# Altium schematic sheet Controller.SchDoc
size A; SheetNumber: 4; SheetTotal: 4
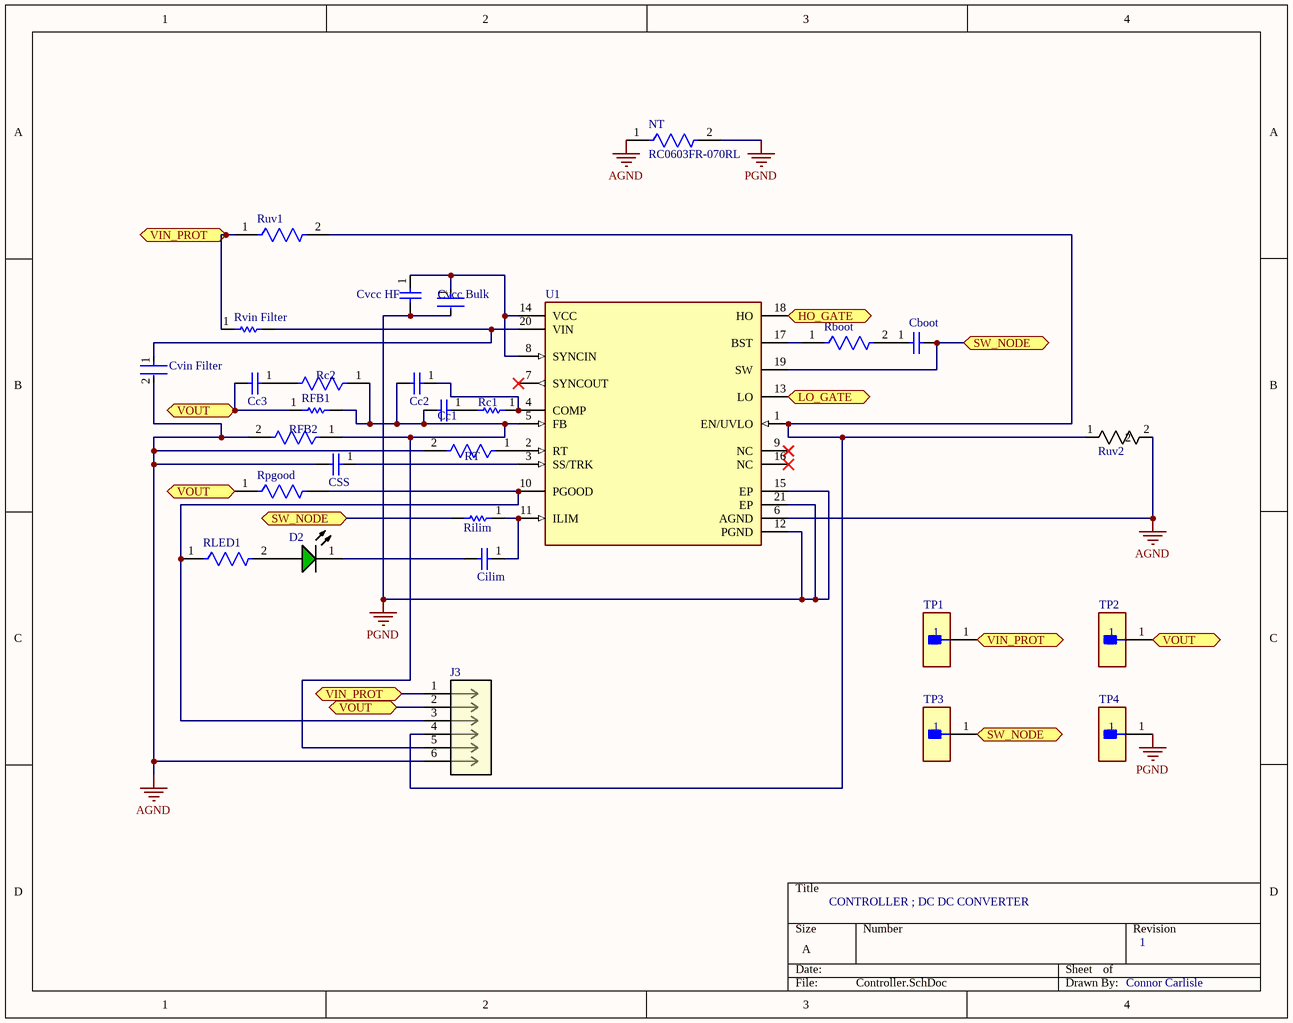
[diagram p0: Controller.SchDoc]

## Parts
Cboot  GRM188R71C104KA01D  [MURA-0603_H_0.9_M]  (value not drawn)
Cc1  GRM188R71H332KA01D  [CAPC1608X90X35LL10T15]  (value not drawn)
Cc2  GRM1885C1H560JA01D  [CAPC1608X90X35NL10T15]  (value not drawn)
Cc3  GRM1885C1H681JA01D  [CAPC1608X90X35ML10T15]  (value not drawn)
Cilim  GRM1885C1H220JA01D  [CAPC1608X90X35ML10T15]  (value not drawn)
CSS  GRM188R71C473KA01D  [CAPC1608X90X35ML10T15]  (value not drawn)
Cvcc_Bulk  GRM188Z71C225KE43D  [FP-GRM188-0_2-MFG]  (value not drawn)
Cvcc_HF  GRM188R71C104KA01D  [MURA-0603_H_0.9_M]  (value not drawn)
Cvin_Filter  GRM188R72A104KA35D  [FP-GRM188-0_1-e0_2_0_5-IPC_B]  (value not drawn)
D2  LTST-C170KGKT  [LTST-LTST-C170KGKT-2_V]  (value not drawn)
J3  PRPC006SAAN-RC  [CONN6_PRPC006SAAN-RC_SUL]  (value not drawn)
NT  RC0603FR-070RL  [FP-RC0603-MFG]
Rboot  RC0603FR-072R2L  [FP-RC0603-0_55-IPC_A]  (value not drawn)
Rc1  RC0603FR-0715KL  [RESC1608X55X25LL10T15]  (value not drawn)
Rc2  RC0603FR-07100RL  [FP-RC0603-0_55-MFG]  (value not drawn)
RFB1  RC0603FR-0752K3L  [RESC1608X55X25LL10T15]  (value not drawn)
RFB2  RC0603FR-0710KL  [FP-RC0603-0_55-IPC_C]  (value not drawn)
Rilim  RC0603FR-07147RL  [RESC1608X55X25NL10T15]  (value not drawn)
RLED1  RC0603FR-071KL  [FP-RC0603-0_55-IPC_C]  (value not drawn)
Rpgood  RC0603FR-07100KL  [FP-RC0603-0_55-MFG]  (value not drawn)
RT  RC0603FR-0720KL  [FP-RC0603-0_55-IPC_C]  (value not drawn)
Ruv1  RC0603FR-07100KL  [FP-RC0603-0_55-MFG]  (value not drawn)
Ruv2  RC0603FR-0717K8L  [RC0603N_YAG]  (value not drawn)
Rvin_Filter  4R7 1% 0603(1608)  [RESC0603(1608)_M]  (value not drawn)
TP1  5015  [FP-5015-MFG]  (value not drawn)
TP2  5015  [FP-5015-MFG]  (value not drawn)
TP3  5015  [FP-5015-MFG]  (value not drawn)
TP4  5015  [FP-5015-MFG]  (value not drawn)
U1  LM5145RGYR  [FP-RGY0020B-MFG]  (value not drawn)

## Ports
HO_GATE (bidir, see Top[2C], Power_Stage[2B]), LO_GATE (bidir, see Top[2C], Power_Stage[3C]), SW_NODE (bidir, see Top[2C], Power_Stage[3B]), VIN_PROT (bidir, see Top[2B], Input_Protection[3B], Power_Stage[1B]), VOUT (bidir, see Top[2C], Power_Stage[3B])

## Nets
AGND: CSS.2 Cvin_Filter.2 J3.6 NT.1 RFB2.2 RT.2 Ruv2.2 U1.6(AGND)
PGND: Cvcc_Bulk.2 Cvcc_HF.2 NT.2 TP4.1 U1.12(PGND) U1.15(EP) U1.21(EP)
HO_GATE: U1.18(HO) ; port HO_GATE
LO_GATE: U1.13(LO) ; port LO_GATE
SW_NODE: Cboot.2 Rilim.2 TP3.1 U1.19(SW) ; port SW_NODE
VIN_PROT: J3.1 Ruv1.1 Rvin_Filter.1 TP1.1 ; port VIN_PROT
VOUT: Cc3.2 J3.2 RFB1.1 Rpgood.1 TP2.1 ; port VOUT
NetCboot_1: Cboot.1 Rboot.2
NetCc1_1: Cc1.1 Rc1.2
NetCc1_2: Cc1.2 Cc2.2 J3.5 Rc2.1 RFB1.2 RFB2.1 U1.5(FB)
NetCc2_1: Cc2.1 Rc1.1 U1.4(COMP)
NetCc3_1: Cc3.1 Rc2.2
NetCilim_1: Cilim.1 Rilim.1 U1.11(ILIM)
NetCilim_2: Cilim.2 D2.1(K)
NetCSS_1: CSS.1 U1.3(SS/TRK)
NetCvcc_Bulk_1: Cvcc_Bulk.1 Cvcc_HF.1 U1.8(SYNCIN) U1.14(VCC)
NetCvin_Filter_1: Cvin_Filter.1 Rvin_Filter.2 U1.20(VIN)
NetD2_2: D2.2(A) RLED1.2
NetJ3_3: J3.3 RLED1.1 Rpgood.2 U1.10(PGOOD)
NetJ3_4: J3.4 Ruv1.2 Ruv2.1 U1.1(EN/UVLO)
NetRboot_1: Rboot.1 U1.17(BST)
NetRT_1: RT.1 U1.2(RT)

Not connected (* = marked no-connect by the designer): U1 7(SYNCOUT)* 9(NC)* 16(NC)*

## Notes on the sheet
- CONTROLLER ; DC DC CONVERTER
- 1
- Connor Carlisle

## Library data of the parts
Cboot Cvcc_HF = CMP-2000-05253-1: CAP, Ceramic, 0.1 uF, 10%, 16 V, 0603, RoHS, Tape and Reel; Manufacturer: Murata; Capacitance - pF: 100000pF; Case Length: 1.6mm; Voltage Rating DC: 16V; Brand: MurataElectronics; Temperature Coefficient / Code: +/-15%; Case Width: 0.8mm; Capacitance: 0.1uF; Dielectric: X7R; Capacitance - nF: 100nF; Product Category: MultilayerCeramicCapacitorsMLCC-SMD/SMT; Datasheet URL: https://datasheet.ciiva.com/29202/451467-da-01-en-vs-kondensator-0603-29202287.pdf; Termination Style: SMD/SMT; Operating Temperature Range: -55Cto+125C; Case Code - in: 0603; Datasheet Version: Dec-10; Dimensions: 0.8mmWx1.6mmLx0.8mmH; RoHS: Details; Case Code - mm: 1608; Product: GeneralTypeMLCCs; Voltage Rating: 16V; Package / Case: 0603(1608metric); Factory Pack Quantity: 4000; Packaging: Reel; Maximum Operating Temperature: +125C; Manufacturer URL: http://www.murata.com/; Type: GeneralPurposeMLCC; Case Height: 0.8mm; Minimum Operating Temperature: -55C; Series: GRM; Tolerance: 10%
Cc1 = CMP-2006-02916-1: Manufacturer: Murata; Part Number: GRM188R71H332KA01D
Cc2 = CMP-2006-02680-1: Manufacturer: Murata; Part Number: GRM1885C1H560JA01D
Cc3 = CMP-2006-02690-1: Manufacturer: Murata; Part Number: GRM1885C1H681JA01D
Cilim = CMP-2000-04945-1: Chip Capacitor, 22 pF, +/- 5%, 50 V, -55 to 125 degC, 0603 (1608 Metric), RoHS, Tape and Reel; Manufacturer: Murata; Capacitance: 22pF; Rated Voltage: 50V; Dielectric: C0G; Manufacturer URL: http://www.murata.com/; Datasheet Version: Jul-06; Package Reference: 603; Tolerance (%): ±5%; Case Size/Dimension: 0603; Package Description: 2-Pin Surface Mount Device, Body 1.6 x 0.8 mm; Datasheet URL: https://datasheet.ciiva.com/11786/0900766b807a1cab-11786398.pdf
CSS = CMP-2006-02858-1: Manufacturer: Murata; Part Number: GRM188R71C473KA01D
Cvcc_Bulk = CMP-06035-057307-1: Chip Multilayer Ceramic Capacitors for General Purpose, 0603, 2.2uF, X7R, 15%, 10%, 16V; Case/Package: 0603
Cvin_Filter = CMP-1035-02595-8: Chip Multilayer Ceramic Capacitors for General Purpose, 0603, 0.10uF, X7R, 15%, 10%, 100V; Capacitance: 100nF; Voltage Rating (DC): 100V; Material: Ceramic; Packaging: Tape and Reel; Dielectric: X7R; Case Code (Imperial): 0603; Package Quantity: 1; Height: 0.8mm; Weight: 0.000222oz; Min Operating Temperature: -55°C; Depth: 0.8mm; Mount: Surface Mount; Thickness: 0.035inch; Voltage: 100V; REACH SVHC: No SVHC; Case/Package: 0603; Voltage Rating: 100V; Width: 0.8mm; Tolerance: 10%; Lead Free: Lead Free; Case Code (Metric): 1608; Radiation Hardening: No; Max Operating Temperature: 125°C; Termination: SMD/SMT; Length: 1.6mm
D2 = CMP-2000-06620-1: Ultra Bright AlInGaP Chip LED, 75 mW, -55 to 85 degC, 2-Pin SMD (0805), RoHS, Tape and Reel; Manufacturer: Lite-On; Forward Current: 30mA; Power Dissipation Max: 75mW; Emitting Color: YellowGreen; Type: Uni-Color; Forward Voltage: 2.4V; Dominant Wave Length: 571nm; Test Current (It): 20mA; Product Length (mm): 2mm; Peak Wavelength: 574nm; Power Dissipation: 75W; Product Depth (mm): 1.25mm; DELETED: Compliant; High Brightness: Yes; Product Height (mm): 1.1mm; Luminous Intensity: 35mcd; Shape Type: Rectangular; Chip Material: AlGaInP; Viewing Angle: 130deg; Number of  Elements: 1; Reverse Voltage: 5V; Rad Hardened: No; Package Type: ChipLed; Manufacturer URL: http://www.us.liteon.com/; Mounting: SurfaceMount; Operating Temp Range: -55Cto85C; Datasheet URL: http://optoelectronics.liteon.com/upload/download/DS22-2000-073/S_110_LTST-C170KGKT.pdf; Packaging: TapeandReel; Pin Count: 2; Package Description: 2-Pin Surface Mounted Device, Body 2 x 1.25 mm; Mounting Technology: SurfaceMount; Package Reference: LTST-C170KGKT-2; Forward Current Max: 30mA; Datasheet Version: Rev. G, 06/2005; Lens Dimensions: 1.4x1.25x0.6mm; Operating Temperature Classification: Industrial; Lum Intensity: 35mcd; Main Category: ChipLED
J3 = CMP-028-000000-1: Description; Manufacturer_Name: Sullins; Type: Headers, Male Pins; Copyright: Copyright (C) 2025 Ultra Librarian. All rights reserved.; Design Item ID: PRPC006SAAN-RC; RefDes: RefDes; Manufacturer_Part_Number: PRPC006SAAN-RC; Source: PRPC006SAAN-RC.SchLib
NT = CMP-2000-06925-2: RES SMD 0 OHM JUMPER 1/10W 0603; Manufacturer: Yageo; Tolerance: 1%; Value: 0Ω; Power Rating: 0.1W; Voltage Rating: 75V; Composition: Thick Film; Temperature Range Low: -55°C; Ipc Land Pattern Name: RESC16080X45; Lead Free: Yes; Digikey Description: RES SMD 0 OHM JUMPER 1/10W 0603; Height: 0.55mm; Automotive: No; Device Class L3: Chip SMD Resistors; Device Class L1: Passive Components; Device Class L2: Resistors; Footprint Url: http://www.yageo.com/exep/pages/download/literatures/PYu-R_Mount_10.pdf; Category: Res; Mouser Description: RC Series 0603 0.1 W 0 O Jumper Surface Mount Thick Film Chip Resistor; Resistance: 0Ω; ComponentLink2URL: http://www.yageo.com/documents/recent/PYu-RC_Group_51_RoHS_L_10.pdf; Series: RC_L; ComponentLink2Description: Datasheet; RoHS: TRUE; Temperature: -55°C to +155°C; Temperature Range High: +155°C; Package: RC0603; Octopart: https://octopart.com/rc0603fr-070rl-yageo-1180803; Manufacturer Part Number: RC0603FR-070RL
Rboot = CMP-03412-037810-1: RES SMD 2.2 OHM 1% 1/10W 0603; Voltage Rating: 50V; Max Power Dissipation: 100mW; Resistance: 2.2R; Temperature Coefficient: 200ppm/°C; Lead Free: Lead Free; Series: RC; Resistor Type: Thick Film; Case Code (Imperial): 0603; Number of Pins: 2; Min Operating Temperature: -55°C; Packaging: Tape and Reel; Length: 0.063inch; Power Rating: 100mW; Features: Moisture Resistant; Resistance Tolerance: 1%; Termination: SMD/SMT; Width: 0.031inch; REACH SVHC: No SVHC; Case Code (Metric): 1608; Height: 0.022inch; Voltage Rating (DC): 50V; Size Code: 0603; Max Operating Temperature: 155°C; Case/Package: 0603; Number of Terminations: 2; Depth: 0.8mm; Tolerance: 1%; RoHS Compliant: Yes; Technology: THICK FILM; Package Quantity: 1
Rc1 = CMP-1659-00032-1: Chip Resistor, 15 KOhm, +/- 1%, 0.1 W, -55 to 155 degC, 0603 (1608 Metric), RoHS, Tape and Reel; PackageDescription: 2-Pin Surface Mount Device, Body 1.6 x 0.8 mm; RoHSCompliant: true; ComponentLink2Description: Datasheet; DatasheetVersion: Rev. 4, 02/2016; ComponentLink1Description: Manufacturer URL; ComponentLink1URL: http://www.yageo.com/; PackageReference: 0603; ComponentLink2URL: http://www.yageo.com/documents/recent/PYu-RC_Group_51_RoHS_L_04.pdf
Rc2 = CMP-2100-03663-2: NexarPartId: 55402879; Voltage Rating: 50V; Power Rating: 100mW; Tolerance: 1%; Temperature Coefficient: 100ppm/°C; Resistance: 100Ω; Case/Package: 0603; Military Standard: Not; REACH SVHC: Unknown; Case Code (Metric): 0603; Max Operating Temperature: 155°C; Schedule B: 8533210045, 8533210045; Height: 450µm; Length: 1.6mm; Lead Free: Lead Free; Packaging: Tape & Reel; Case Code (Imperial): 0603; Composition: Thick Film; Min Operating Temperature: -55°C; Voltage Rating (DC): 50V; RoHS: Compliant; Depth: 800µm; Number of Pins: 2; Termination: SMD/SMT; Width: 800µm
RFB1 = CMP-1012-00705-2: Manufacturer: Yageo; Part Number: RC0603FR-0752K3L
RFB2 = CMP-2100-03664-2: RES 10K OHM 1% 1/10W 0603; Voltage Rating: 75V; Voltage Rating (DC): 50V; Resistance: 10kR; Power Rating: 100mW; Temperature Coefficient: 100ppm/°C; Depth: 0.8mm; Termination: SMD/SMT; Resistor Type: Thick Film; Series: RC; Construction: Rectangular; Features: Moisture Resistant; Packaging: Tape and Reel; Min Operating Temperature: -55°C; Number of Terminations: 2; Lead Pitch: 0.3mm; RoHS Compliant: Yes; Case/Package: 0603; Resistance Tolerance: 1%; Military Standard: Not; Weight: 7.1E-05oz; Number of Pins: 2; Tolerance: 1%; Length: 1.6mm; Case Code (Imperial): 0603; Lead Free: Lead Free; Width: 0.8mm; Max Power Dissipation: 100mW; Height: 0.45mm; Max Operating Temperature: 155°C; Case Code (Metric): 1608; Size Code: 0603
Rilim = CMP-2000-04904-1: Manufacturer: Yageo; Part Number: RC0603FR-07147RL
RLED1 = CMP-1659-00009-5: RES 1K OHM 1% 1/10W 0603; Resistance: 1kR; Voltage Rating: 50V; Power Rating: 100mW; Temperature Coefficient: 100ppm/°C; Military Standard: Not; REACH SVHC: No SVHC; Size Code: 0603; Features: Moisture Resistant; Number of Terminations: 2; Technology: THICK FILM; Series: RC; Case Code (Metric): 1608; Resistance Tolerance: 1%; Resistor Type: Thick Film; Termination: SMD/SMT; Contact Plating: Tin; Radiation Hardening: No; Min Operating Temperature: -55°C; Max Operating Temperature: 155°C; Packaging: Tape and Reel; Max Power Dissipation: 100mW; RoHS Compliant: Yes; Height: 0.45mm; Lead Free: Lead Free; Case/Package: 0603; Length: 1.6mm; Tolerance: 1%; Case Code (Imperial): 0603; Construction: Rectangular; Depth: 0.8mm
Rpgood Ruv1 = CMP-2100-03662-2: RES SMD 100K OHM 1% 1/10W 0603; Voltage Rating (DC): 50V; Resistance: 100kR; Max Power Dissipation: 100mW; Temperature Coefficient: 100ppm/°C; Working Voltage: 75V; Length: 1.6mm; Lead Free: Lead Free; Number of Terminations: 2; Packaging: Tape and Reel; Voltage Rating: 50V; Termination: SMD/SMT; Width: 0.8mm; Resistor Type: Thick Film; Resistance Tolerance: 1%; Features: Moisture Resistant; Height: 0.45mm; Construction: Rectangular; Case/Package: 0603; Military Standard: Not; Case Code (Imperial): 0603; Series: RC; Technology: THICK FILM; Depth: 0.8mm; RoHS Compliant: Yes; REACH SVHC: No SVHC; Min Operating Temperature: -55°C; Case Code (Metric): 1608; Max Operating Temperature: 155°C; Power Rating: 100mW; Number of Pins: 2; Tolerance: 1%
RT = CMP-2000-06932-2: RES 20K OHM 1% 1/10W 0603; Voltage Rating: 50V; Temperature Coefficient: 100ppm/°C; Power Rating: 100mW; Resistance: 20kR; Height: 0.022inch; REACH SVHC: No SVHC; Case Code (Metric): 1608; Depth: 0.8mm; Tolerance: 1%; Min Operating Temperature: -55°C; Series: RC; RoHS Compliant: Yes; Resistor Type: Thick Film; Max Power Dissipation: 100mW; Features: Moisture Resistant; Max Operating Temperature: 155°C; Package Quantity: 1; Size Code: 0603; Packaging: Tape and Reel; Width: 0.031inch; Length: 0.063inch; Military Standard: Not; Technology: THICK FILM; Number of Terminations: 2; Termination: SMD/SMT; Construction: Rectangular; Case/Package: 0603; Number of Pins: 2; Lead Free: Lead Free; Voltage Rating (DC): 50V; Resistance Tolerance: 1%; Case Code (Imperial): 0603
Ruv2 = CMP-009-00179-1: No Description Available; Manufacturer_Name: Yageo; Manufacturer_Part_Number: RC0603FR-0717K8L; Copyright: Copyright (C) 2026 Ultra Librarian. All rights reserved.; Source: RC0603FR-0717K8L.SchLib; Design Item ID: RC0603FR-0717K8L
Rvin_Filter = CMP-1012-00247-1: 4R7 0.1W 1% 0603 (1608 Metric)  SMD; Case-EIA: 0603; Case-Metric: 1608; Value: 4.70 Ohm; Power: 0.1 W; Technology: SMT; Tolerance: 1 %
TP1-TP4 = CMP-2000-05183-2: PC TEST POINT MINIATURE; Manufacturer: keystone; Number Of Contacts: 1; Conn Orientation: Straight; Category: Conn; Manufacturer Part Number: 5015; Digikey Description: PC TEST POINT MINIATURE; Automotive: No; Lead Free: Yes; Octopart: https://octopart.com/5015-keystone-3822; ComponentLink2URL: http://www.keyelco.com/product-pdf.cfm?p=1353; Package: 5015; RoHS: TRUE; Device Class L3: unset; Device Class L2: unset; Contact Material: Silver; Device Class L1: Connectors; Height: 1.65mm; ComponentLink2Description: Datasheet
U1 = CMP-00024-00006-1: LM5145 Buck Tape & Reel (TR) e3 DC to DC switching controller 1mm 75V 100kHz~1MHz -40C~125C TJ; Nominal Supply Current: 1.8mA; Case/Package: VQFN; Pins: 20; Min Operating Temperature: -40°C; Max Operating Temperature: 125°C